# EAGLE schematic schematic_2 (EAGLE 7.2.0)
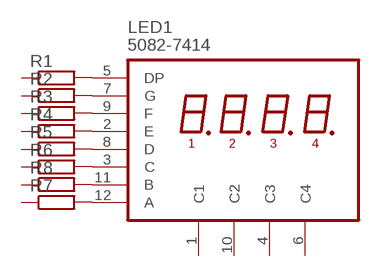
[diagram p0: schematic, sheet 1]

## Parts
LED1  5082-7414  [5082-7414]
R1  R-EU_0204/2V  [0204V]
R2  R-EU_0204/2V  [0204V]
R3  R-EU_0204/2V  [0204V]
R4  R-EU_0204/2V  [0204V]
R5  R-EU_0204/2V  [0204V]
R6  R-EU_0204/2V  [0204V]
R7  R-EU_0204/2V  [0204V]
R8  R-EU_0204/2V  [0204V]

## Nets
N$1: LED1.5(DP) R1.2
N$2: LED1.7(G) R2.2
N$3: LED1.9(F) R3.2
N$4: LED1.2(E) R4.2
N$5: LED1.8(D) R5.2
N$6: LED1.3(C) R6.2
N$7: LED1.12(A) R7.2
N$8: LED1.11(B) R8.2
Unconnected: LED1.1(C1) LED1.4(C3) LED1.6(C4) LED1.10(C2) R1.1 R2.1 R3.1 R4.1 R5.1 R6.1 R7.1 R8.1

## Library data of the parts
LED1 = hp-displays:5082-7414: 4 digits X 7-segment + DP LED display
R1-R8 = rcl:R-EU_: RESISTOR, European symbol